# EAGLE design implant 5.3_marino5_doubleboost_3.8mm (EAGLE 9.2.2)
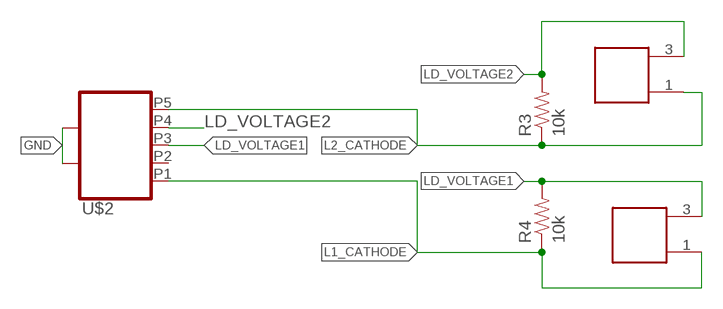
[diagram p0: schematic, sheet 1]

## Parts
R3  10k  RESISTOR0805-RES  [0805]
R4  10k  RESISTOR0805-RES  [0805]
U$2  USB_MICRO_SOCKET_VERT  [USB_VERT_MICRO_SMD]
U$4  TEST1  [LASERDIODE_3.8_NEW]
U$5  TEST1  [LASERDIODE_3.8_NEW]

## Nets
GND: U$2.P$1 U$2.P$2 U$2.P$3
L1_CATHODE: R4.1 U$2.P1 U$5.1
L2_CATHODE: R3.1 U$2.P5 U$4.1
LD_VOLTAGE1: R4.2 U$2.P3 U$5.3
LD_VOLTAGE2: R3.2 U$2.P4 U$4.3
Unconnected: U$2.P2

## Library data of the parts
R3 R4 = Andy-library:RESISTOR: Resistor Basic schematic elements and footprints for 0603, 1206, and PTH resistors.
U$2 = Cerebro-library:USB_MICRO_SOCKET: horizontal socket. Digikey 609-4616-1-ND
U$4 U$5 = Andy-library:TEST1

## Net classes
0 default: clearance 0.205 mm

## Board
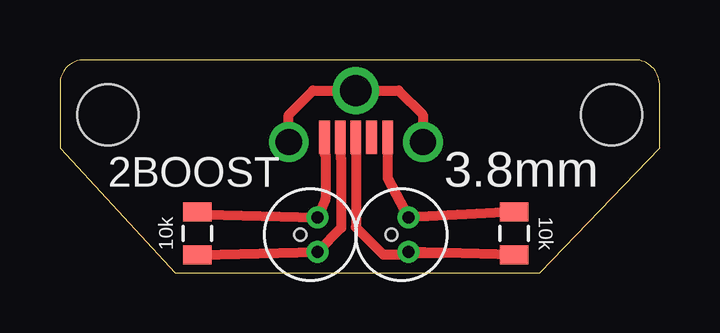
[diagram p1: board, top side]

Size 25.01 x 8.89 mm. Coordinates in mm from the lower left corner, seen from the top.
Outline: 0,7.89 0,5.2 4.8,0 20,0 25,5.2 25,7.69 arc90 24.07,8.89 1,8.89 arc90 0,7.89
Copper layers (1*16): Top 0.035559375mm / dielectric 1.6mm / Bottom 0.035559375mm
Design rules "oshpark-2layer *": minimum track width 6mil, minimum drill 10mil, track to track 6mil, track to pad 6mil, pad to pad 6mil, via to via 6mil, smd to smd 6mil, copper to edge 15mil, drill to drill 6mil, minimum pad ring 5mil, minimum via ring 5mil, stop-mask expansion 2.5mil, vias tented up to drill 0.35mm, thermal gap 10mil
Holes 2.54 mm at 2,6.6 23,6.6

### Footprints (pad centres in the part's own frame; a part is rotated, then mirrored left to right if it is on the bottom)
0805 = smd 0.8 x 1.2: 1 -0.9,0; 2 0.9,0
USB_VERT_MICRO_SMD = smd 0.45 x 1.4: P1 -1.33,-0.2; P2 -0.65,-0.2; P3 0,-0.2; P4 0.65,-0.2; P5 1.3,-0.2 | drill 1.1: P$1 -2.8,0; P$2 2.8,0 | drill 1.3: P$3 0,-2.15
LASERDIODE_3.8_NEW = drill 0.5 pad 0.914: 1 -0.715,0.3; 3 0.715,0.3 | hole 0.498: 0,-0.415

### Placement (x,y rotation side)
R3  5.73,1.65 270 top
R4  18.94,1.65 270 top
U$2  12.34,5.46 180 top
U$4  10.44,1.6 270 top
U$5  14.23,1.6 270 top

### Tracks (layer width: path | path; a pad name or v marks a point on that pad's centre or on a via)
GND
  Top 0.406: 9.52,5.45 U$2.P$2 9.54,6.6 10.55,7.61 U$2.P$3 14.12,7.61 15.13,6.6 U$2.P$1
L1_CATHODE
  Top 0.406: R4.1 U$5.1 13.66,3.95 U$2.P1
L2_CATHODE
  Top 0.406: 6.03,2.45 R3.1 | U$2.P5 11.04,4.95 11.06,4.95 11.06,3.08 U$4.1 6.03,2.45 | 6.03,2.45 6.07,2.45
LD_VOLTAGE1
  Top 0.406: 18.84,0.65 R4.2 16.01,0.84 | 16.01,0.84 U$5.3 | 16.01,0.84 14.24,0.84 14.16,0.77 13.47,0.77 12.34,1.91 U$2.P3
LD_VOLTAGE2
  Top 0.406: R3.2 5.86,0.75 U$4.3 11.72,1.87 11.72,4.77 11.7,4.79 11.7,5.64 U$2.P4

### Text on the board
tNames: 2BOOST | 3.8mm